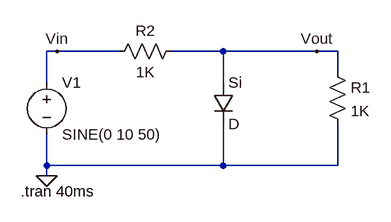
[diagram p0: schematic Draft8.asc]
Draft8.asc, the LTspice schematic file:
Version 4.1
SHEET 1 880 680
WIRE -48 80 -64 80
WIRE 48 80 -48 80
WIRE 208 80 128 80
WIRE 352 80 208 80
WIRE 384 80 352 80
WIRE 384 112 384 80
WIRE -64 128 -64 80
WIRE 208 128 208 80
WIRE -64 256 -64 208
WIRE 208 256 208 192
WIRE 208 256 -64 256
WIRE 384 256 384 192
WIRE 384 256 208 256
WIRE -64 272 -64 256
FLAG -48 80 Vin
FLAG 352 80 Vout
FLAG -64 272 0
SYMBOL voltage -64 112 R0
SYMATTR InstName V1
SYMATTR Value SINE(0 10 50)
SYMBOL res 368 96 R0
SYMATTR InstName R1
SYMATTR Value 1K
SYMBOL res 144 64 R90
WINDOW 0 0 56 VBottom 2
WINDOW 3 32 56 VTop 2
SYMATTR InstName R2
SYMATTR Value 1K
SYMBOL diode 192 128 R0
SYMATTR InstName Si
TEXT -104 296 Left 2 !.tran 40ms

The netlist it stands for:
* Draft8.asc
V1 Vin 0 SINE(0 10 50)
R1 Vout 0 1K
R2 Vout Vin 1K
D§Si Vout 0 D
.model D D
.lib standard.dio
.tran 40ms
.backanno
.end